# Altium schematic sheet Modem.SchDoc
size A4; Organization: Altium Limited; Address1: L3, 12a Rodborough Rd; Address2: Frenchs Forest; Address3: NSW; Address4: Australia 2086
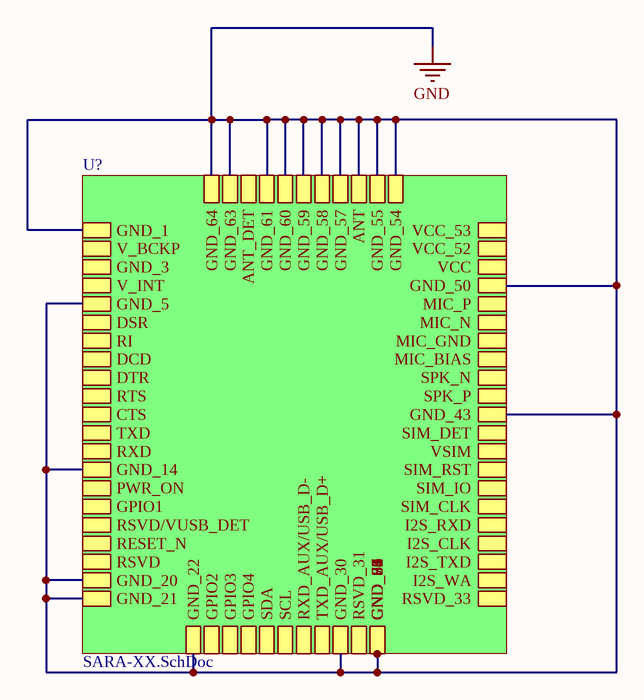
[diagram p0: Modem.SchDoc]

## Sub-sheets
U? = SARA-XX.SchDoc: GND, GND_66, GND_67, GND_68, GND_69, GND_70, GND_71, GND_72, GND_73, GND_74, GND_75, GND_76, GND_77, GND_78, GND_79, GND_80, GND_81, GND_82, GND_83, GND_84, GND_85, GND_86, GND_87, GND_88, GND_89, GND_90, GND_91, GND_92, GND_93, GND_94, GND_95, GND_96, GND_1, V_BCKP, GND_3, V_INT, GND_5, DSR, RI, DCD, DTR, RTS, CTS, TXD, RXD, GND_14, PWR_ON, GPIO1, RSVD/VUSB_DET, RESET_N, RSVD, GND_20, GND_21, GND_22, GPIO2, GPIO3, GPIO4, SDA, SCL, RXD_AUX/USB_D-, TXD_AUX/USB_D+, GND_30, RSVD_31, GND_32, RSVD_33, I2S_WA, I2S_TXD, I2S_CLK, I2S_RXD, SIM_CLK, SIM_IO, SIM_RST, VSIM, SIM_DET, GND_43, SPK_P, SPK_N, MIC_BIAS, MIC_GND, MIC_N, MIC_P, GND_50, VCC, VCC_52, VCC_53, GND_54, GND_55, ANT, GND_57, GND_58, GND_59, GND_60, GND_61, ANT_DET, GND_63, GND_64

## Nets
GND: sheet U?/GND, sheet U?/GND_66, sheet U?/GND_67, sheet U?/GND_68, sheet U?/GND_69, sheet U?/GND_70, sheet U?/GND_71, sheet U?/GND_72, sheet U?/GND_73, sheet U?/GND_74, sheet U?/GND_75, sheet U?/GND_76, sheet U?/GND_77, sheet U?/GND_78, sheet U?/GND_79, sheet U?/GND_80, sheet U?/GND_81, sheet U?/GND_82, sheet U?/GND_83, sheet U?/GND_84, sheet U?/GND_85, sheet U?/GND_86, sheet U?/GND_87, sheet U?/GND_88, sheet U?/GND_89, sheet U?/GND_90, sheet U?/GND_91, sheet U?/GND_92, sheet U?/GND_93, sheet U?/GND_94, sheet U?/GND_95, sheet U?/GND_96, sheet U?/GND_1, sheet U?/GND_5, sheet U?/GND_14, sheet U?/GND_20, sheet U?/GND_21, sheet U?/GND_22, sheet U?/GND_30, sheet U?/GND_32, sheet U?/GND_43, sheet U?/GND_50, sheet U?/GND_54, sheet U?/GND_55, sheet U?/ANT, sheet U?/GND_57, sheet U?/GND_58, sheet U?/GND_59, sheet U?/GND_60, sheet U?/GND_61, sheet U?/GND_63, sheet U?/GND_64

## Notes on the sheet
- Title
- Size:
- Date:
- A4
- Number:
- Time:
- Revision:
- Sheet
- of
- File: